# EAGLE design SHT1x-Breakout (EAGLE 7.2.0)
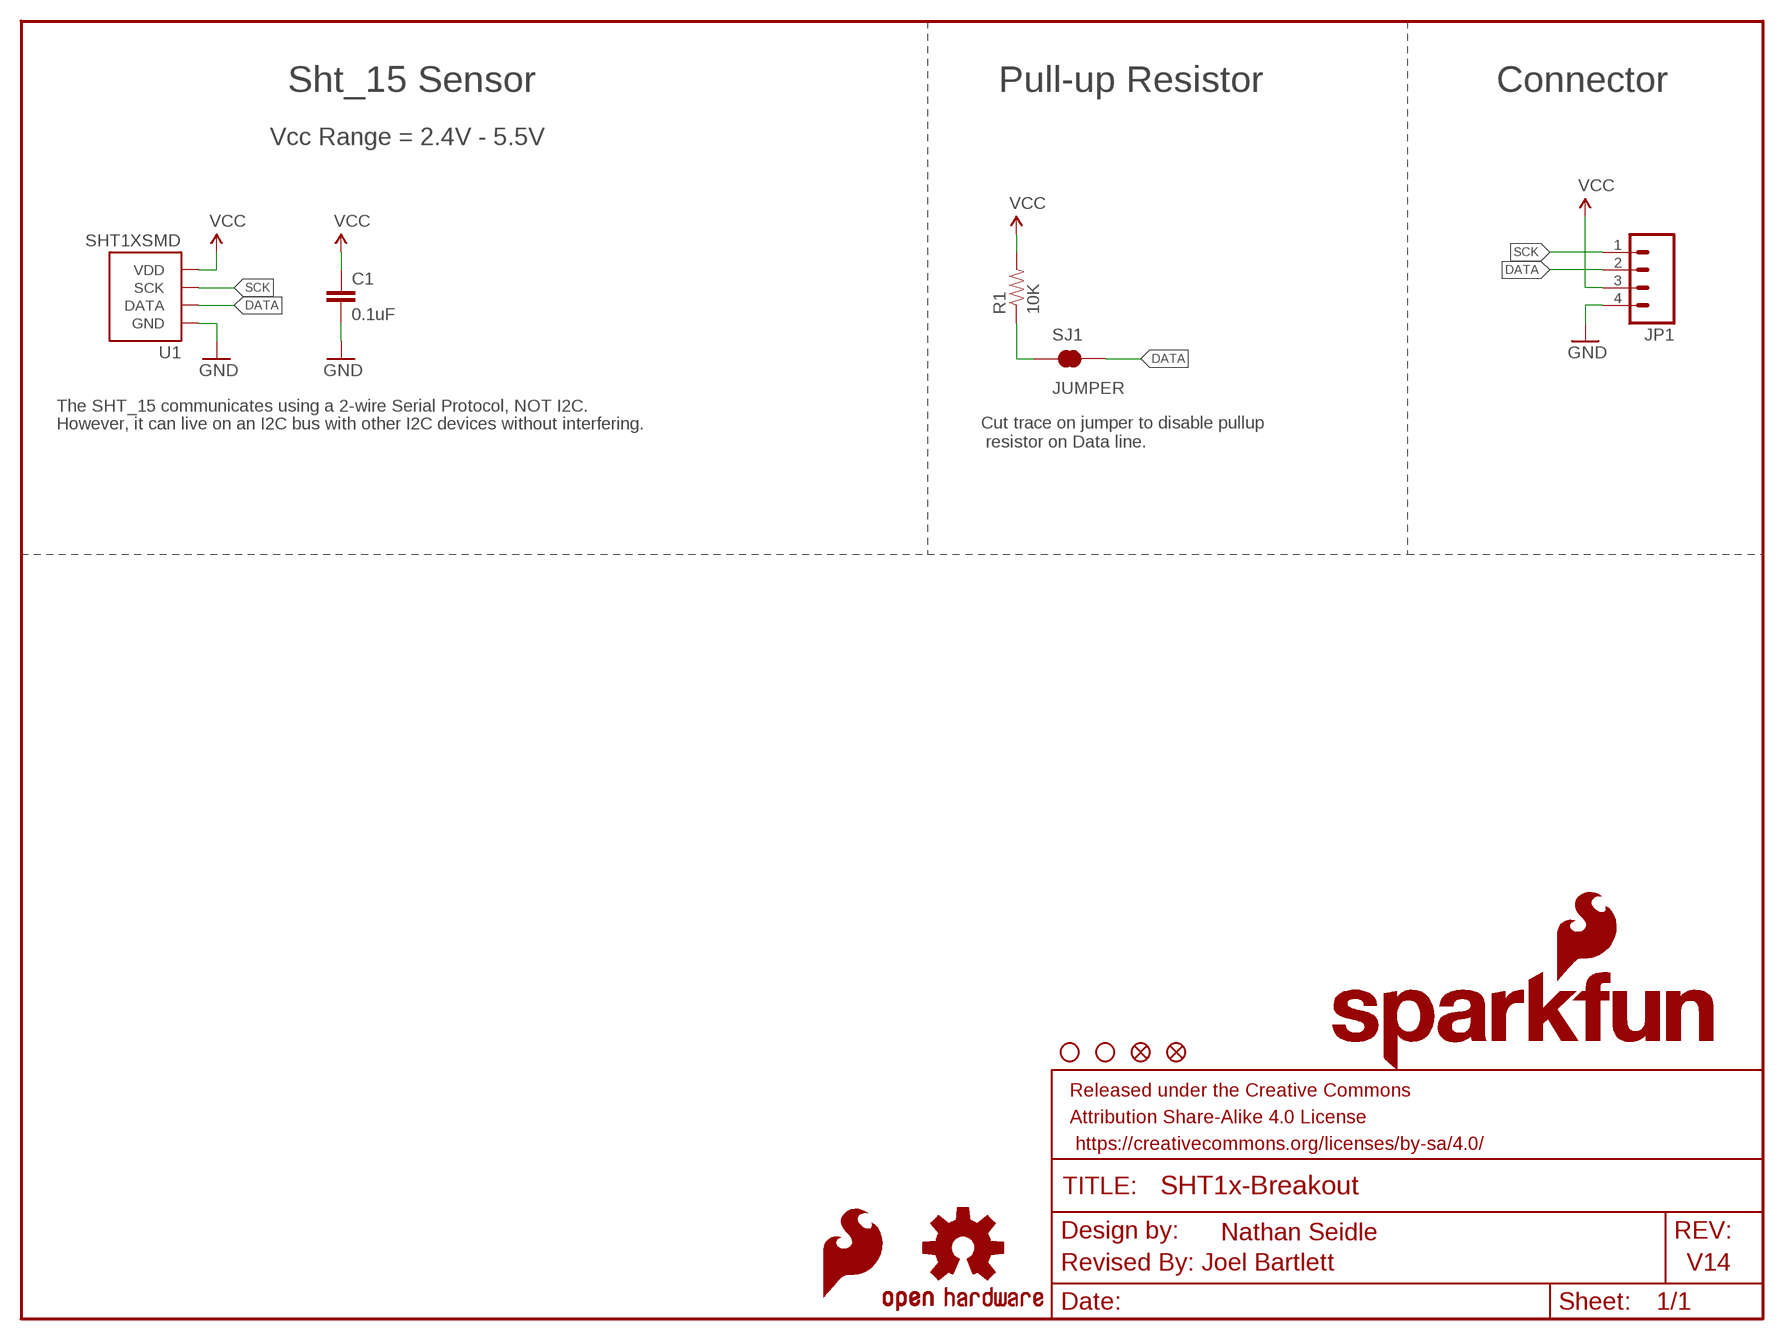
[diagram p0: schematic, sheet 1]

## Parts
C1  0.1uF  0.1UF-25V(+80/-20%)(0603)  [0603-CAP]
FID1  FIDUCIAL1X2  [FIDUCIAL-1X2]
FID2  FIDUCIAL1X2  [FIDUCIAL-1X2]
FRAME1  FRAME-LETTER  [CREATIVE_COMMONS]
JP1  M04PTH  [1X04]
LOGO1  OSHW-LOGOS  [OSHW-LOGO-S]
LOGO2  SFE_LOGO_NAME.1_INCH  [SFE_LOGO_NAME_.1]
LOGO4  SFE_LOGO_FLAME.1_INCH  [SFE_LOGO_FLAME_.1]
LOGO5  SFE_LOGO_NAME_FLAME.1_INCH  [SFE_LOGO_NAME_FLAME_.1]
R1  10K  10KOHM-1/10W-1%(0603)0603  [0603-RES]
SJ1  JUMPER  JUMPER-PAD-2-NC_BY_TRACE  [PAD-JUMPER-2-NC_BY_TRACE_YES_SILK]
STANDOFF1  STAND-OFF  [STAND-OFF]
STANDOFF2  STAND-OFF  [STAND-OFF]
U1  SHT1XSMD  [SHT1X]

## Nets
DATA: JP1.2 SJ1.2 U1.2(DATA)
GND: C1.2 JP1.4 U1.1(GND)
N$1: R1.1 SJ1.1
SCK: JP1.1 U1.3(SCK)
VCC: C1.1 JP1.3 R1.2 U1.4(VDD)

## Notes on the sheet
- Sht_15 Sensor | Pull-up Resistor | Connector
- Vcc Range = 2.4V - 5.5V
- The SHT_15 communicates using a 2-wire Serial Protocol, NOT I2C.
- However, it can live on an I2C bus with other I2C devices without interfering.
- Cut trace on jumper to disable pullup
   resistor on Data line.
- Nathan Seidle
- Revised By: Joel Bartlett | V14

## Library data of the parts
C1 = SparkFun-Capacitors:0.1UF-25V(+80/-20%)(0603): CAP-00810 Ceramic Standard decoupling cap; PROD_ID: CAP-00810
FID1 FID2 = SparkFun-Aesthetics:FIDUCIAL: Fiducial Alignment Points Various fiducial points for machine vision alignment.
FRAME1 = SparkFun-Aesthetics:FRAME-LETTER: Schematic Frame Standard 8.5x11 US Letter frame
JP1 = SparkFun:M04: Header 4 Standard 4-pin 0.1" header. Use with straight break away headers (SKU : PRT-00116), right angle break away headers (PRT-00553), swiss pins (PRT-00743), machine pins (PRT-00117), and female headers (PRT-00115). Molex polarized connector foot print use with SKU : PRT-08231 with associated crimp pins and housings.
LOGO1 = SparkFun-Aesthetics:OSHW-LOGO: Open Source Hardware Logo This logo indicates the piece of hardware it is found on incorporates a OSHW license and/or adheres to the definition of open source hardware found here: http://freedomdefined.org/OSHW
LOGO2 = SparkFun-Aesthetics:SFE_LOGO_NAME: SFE Logo, name only This is the SparkFun name logo. The logo on the schematic will always be the same size; the package variant is the height of the flame part of the logo (or the height the flame would be, if it were drawn). Default layer for the logo on the board is tSilk.
LOGO4 = SparkFun-Aesthetics:SFE_LOGO_FLAME: SFE Logo, flame only This is the SparkFun flame logo. The logo on the schematic will always be the same size; the package variant is the height of the flame. Default layer for the logo on the board is tSilk.
LOGO5 = SparkFun-Aesthetics:SFE_LOGO_NAME_FLAME: SFE Logo, name and flame This is the SparkFun full logo. The logo on the schematic will always be the same size; the package variant is the height of the flame part of the logo. Default layer for the logo on the board is tSilk.
R1 = SparkFun-Resistors:10KOHM-1/10W-1%(0603): RES-00824; PROD_ID: RES-00824
SJ1 = SparkFun-Passives:JUMPER-PAD-2-NC_BY_TRACE
STANDOFF1 STANDOFF2 = SparkFun-Electromechanical:STAND-OFF: #4 Stand Off This is the mechanical footprint for a #4 phillips button head screw. Use the keepout ring to avoid running the screw head into surrounding components. SKU : PRT-00447
U1 = SparkFun-Sensors:SHT1X: SHT1x Humdity Sensor Sensirion humdity sensor. Schematic element and footprint proven. Spark Fun Electronics SKU : COM-08227; PROD_ID: IC-08303

## Net classes
0 default: width 0.203 mm
1 power: width 0.305 mm

## Board
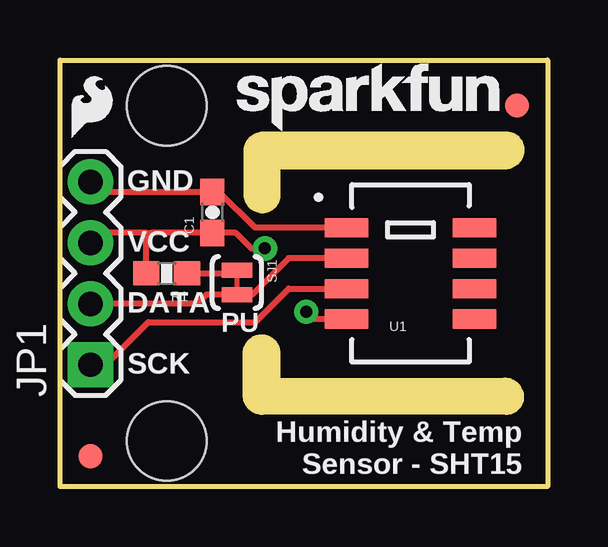
[diagram p1: board, top side]
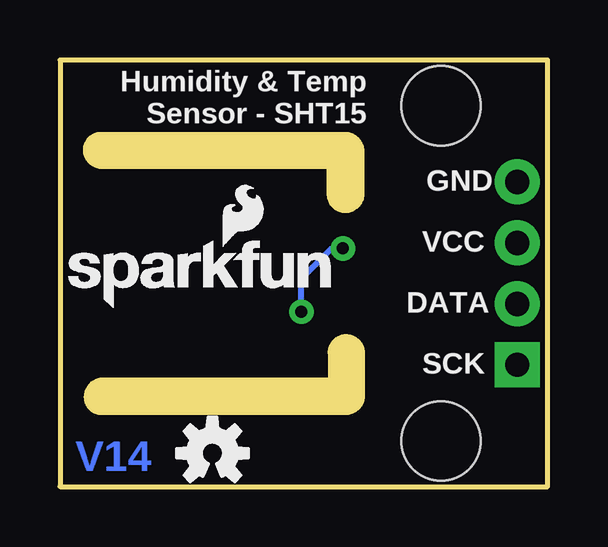
[diagram p2: board, bottom side, seen from below]

Size 20.32 x 17.78 mm. Coordinates in mm from the lower left corner, seen from the top.
Outline: 0,17.78 20.32,17.78 20.32,0 0,0 0,17.78
Outline: 7.75,13.97 7.75,12.19 arc90 8.43,11.51 arc90 9.09,12.17 9.09,13.34 18.54,13.34 arc90 19.25,14.05 arc90 18.62,14.68 8.46,14.68 arc90 7.75,13.97
Outline: 7.72,3.81 7.72,5.56 arc-90 8.41,6.25 arc-90 9.07,5.56 9.07,4.45 18.52,4.45 arc-90 19.23,3.73 arc-90 18.59,3.1 8.43,3.1 arc-90 7.72,3.81
Copper layers (1*16): Top 0.035mm / dielectric 1.5mm / Bottom 0.035mm
Design rules "SparkFun": minimum track width 8mil, minimum drill 20mil, track to track 8mil, track to pad 8mil, pad to pad 8mil, via to via 8mil, smd to smd 8mil, copper to edge 9mil, drill to drill 8mil, minimum pad ring 12mil, minimum via ring 10mil, stop-mask expansion 4mil, vias tented up to drill 20mil, thermal gap 10mil
Milling: 4 lines

### Footprints (pad centres in the part's own frame; a part is rotated, then mirrored left to right if it is on the bottom)
0603-CAP = smd 1.1 x 1: 1 -0.85,0; 2 0.85,0
FIDUCIAL-1X2 = smd 1 x 1: 1 0,0
1X04 = drill 1.016 pad 1.88 square: 1 0,0 | drill 1.016 pad 1.88: 2 2.54,0; 3 5.08,0; 4 7.62,0
0603-RES = smd 1.1 x 1: 1 -0.85,0; 2 0.85,0
PAD-JUMPER-2-NC_BY_TRACE_YES_SILK = smd 0.635 x 1.27: 1 -0.508,0; 2 0.508,0
STAND-OFF = hole 3.302: 0,0
SHT1X = smd 1.8 x 0.8: 1 -2.667,1.905; 2 -2.667,0.635; 3 -2.667,-0.635; 4 -2.667,-1.905; 5 2.667,-1.905; 6 2.667,-0.635; 7 2.667,0.635; 8 2.667,1.905

### Placement (x,y rotation side)
C1  6.35,11.43 90 top
FID1  19.05,15.88 0 top
FID2  1.27,1.27 0 top
FRAME1  -17.78,-10.16 0 top  (outside the outline)
JP1  1.27,5.08 90 top
LOGO1  13.97,1.4 0 bottom
LOGO2  6.88,14.33 0 top
LOGO4  0.18,14.2 0 top
LOGO5  20.4,7.37 0 bottom
R1  4.45,8.89 180 top
SJ1  7.37,8.51 270 top
STANDOFF1  4.45,15.88 0 top
STANDOFF2  4.45,1.91 0 top
U1  14.61,8.89 0 top

### Tracks (layer width: path | path; a pad name or v marks a point on that pad's centre or on a via)
DATA
  Top 0.254: U1.2 9.53,9.53 8,8 SJ1.2 6.1,8 5.71,7.62 JP1.2
GND
  Top 0.254: U1.1 8.13,10.79 6.64,12.28 C1.2 1.69,12.28 JP1.4
N$1
  Top 0.254: R1.1 7.24,8.89 SJ1.1
SCK
  Top 0.254: U1.3 9.53,8.26 8.13,6.86 3.68,6.86 1.91,5.08 JP1.1
VCC  (via drill 0.51)
  Top 0.254: 3.6,10.58 1.69,10.58 JP1.3 | U1.4 10.57,6.99 v10.26,7.29 | v8.53,9.93 7.98,9.93 7.33,10.58 C1.1 3.81,10.58 3.6,10.58 | R1.2 3.6,10.58
  Bottom 0.254: v10.26,7.29 10.26,8.66 8.99,9.93 v8.53,9.93

### Text on the board
Bottom: V14
Dimension: Route Out | Route Out
tPlace: GND | VCC | DATA | PU | SCK | Humidity & Temp / Sensor - SHT15
bPlace: Humidity & Temp / Sensor - SHT15 | GND | VCC | DATA | SCK
tDocu: Nathan Seidle | Revised By: | Joel Bartlett